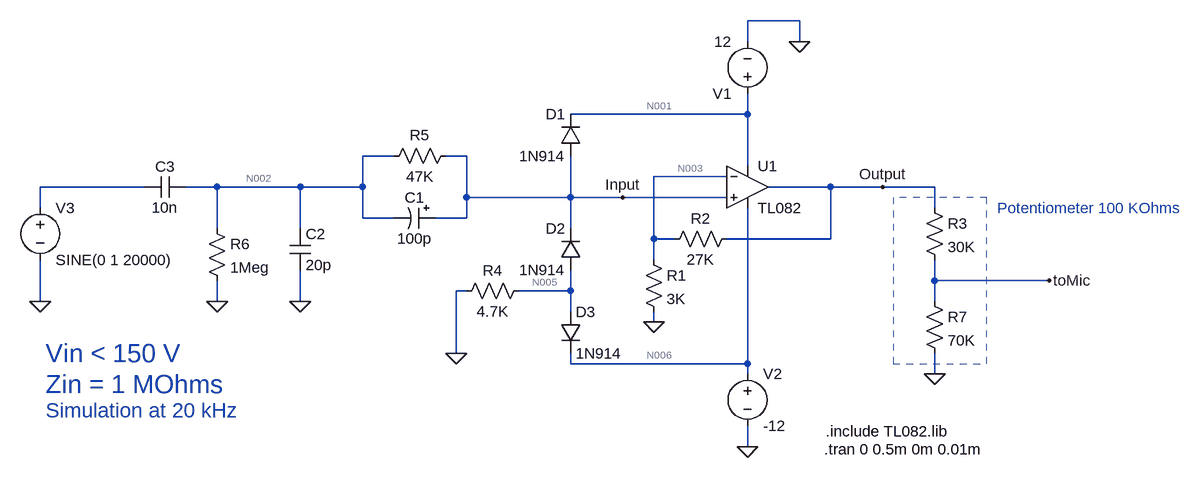
[diagram p0: schematic probes.asc]
probes.asc, the LTspice schematic file:
Version 4
SHEET 1 1404 680
WIRE 752 -240 672 -240
WIRE 672 -208 672 -240
WIRE 752 -208 752 -240
WIRE 672 -96 672 -128
WIRE 672 -96 400 -96
WIRE 128 -32 80 -32
WIRE 240 -32 208 -32
WIRE 672 -16 672 -96
WIRE 640 0 528 0
WIRE -256 16 -416 16
WIRE -144 16 -192 16
WIRE -16 16 -144 16
WIRE 80 16 80 -32
WIRE 80 16 -16 16
WIRE 800 16 704 16
WIRE 880 16 800 16
WIRE 960 16 880 16
WIRE 240 32 240 -32
WIRE 400 32 400 -32
WIRE 400 32 240 32
WIRE 480 32 400 32
WIRE 640 32 480 32
WIRE -416 48 -416 16
WIRE 960 48 960 16
WIRE 80 64 80 16
WIRE 128 64 80 64
WIRE 240 64 240 32
WIRE 240 64 192 64
WIRE -144 80 -144 16
WIRE -16 80 -16 16
WIRE 400 80 400 32
WIRE 528 96 528 0
WIRE 560 96 528 96
WIRE 800 96 800 16
WIRE 800 96 640 96
WIRE 528 128 528 96
WIRE 960 160 960 128
WIRE 1136 160 960 160
WIRE 240 176 224 176
WIRE 400 176 400 144
WIRE 400 176 320 176
WIRE -416 192 -416 128
WIRE -144 192 -144 160
WIRE -16 192 -16 144
WIRE 960 192 960 160
WIRE 400 208 400 176
WIRE 528 224 528 208
WIRE 224 272 224 176
WIRE 400 288 400 272
WIRE 672 288 672 48
WIRE 672 288 400 288
WIRE 672 304 672 288
WIRE 960 304 960 272
WIRE 672 416 672 384
FLAG 672 416 0
FLAG 752 -208 0
FLAG 224 272 0
FLAG -144 192 0
FLAG -16 192 0
FLAG -416 192 0
FLAG 960 304 0
FLAG 528 224 0
FLAG 880 16 Output
FLAG 480 32 Input
FLAG 1136 160 toMic
SYMBOL voltage 672 -112 R180
WINDOW 123 0 0 Left 2
WINDOW 39 0 0 Left 2
SYMATTR InstName V1
SYMATTR Value 12
SYMBOL voltage 672 288 R0
WINDOW 123 0 0 Left 2
WINDOW 39 0 0 Left 2
SYMATTR InstName V2
SYMATTR Value -12
SYMBOL res 512 112 R0
SYMATTR InstName R1
SYMATTR Value 3K
SYMBOL res 656 80 R90
WINDOW 0 0 56 VBottom 2
WINDOW 3 32 56 VTop 2
SYMATTR InstName R2
SYMATTR Value 27K
SYMBOL res 944 32 R0
SYMATTR InstName R3
SYMATTR Value 30K
SYMBOL diode 416 -32 R180
WINDOW 0 24 64 Left 2
WINDOW 3 24 0 Left 2
SYMATTR InstName D1
SYMATTR Value 1N914
SYMBOL diode 416 144 R180
WINDOW 0 24 64 Left 2
WINDOW 3 24 0 Left 2
SYMATTR InstName D2
SYMATTR Value 1N914
SYMBOL diode 384 208 R0
SYMATTR InstName D3
SYMATTR Value 1N914
SYMBOL res 336 160 R90
WINDOW 0 0 56 VBottom 2
WINDOW 3 32 56 VTop 2
SYMATTR InstName R4
SYMATTR Value 4.7K
SYMBOL polcap 192 48 R90
WINDOW 0 0 32 VBottom 2
WINDOW 3 32 32 VTop 2
SYMATTR InstName C1
SYMATTR Value 100p
SYMATTR Description Capacitor
SYMATTR Type cap
SYMATTR SpiceLine V=16
SYMBOL res 224 -48 R90
WINDOW 0 0 56 VBottom 2
WINDOW 3 32 56 VTop 2
SYMATTR InstName R5
SYMATTR Value 47K
SYMBOL cap -32 80 R0
SYMATTR InstName C2
SYMATTR Value 20p
SYMBOL res -160 64 R0
SYMATTR InstName R6
SYMATTR Value 1Meg
SYMATTR SpiceLine tol=1 pwr=0.1
SYMBOL cap -192 0 R90
WINDOW 0 0 32 VBottom 2
WINDOW 3 32 32 VTop 2
SYMATTR InstName C3
SYMATTR Value 10n
SYMBOL voltage -416 32 R0
WINDOW 123 0 0 Left 2
WINDOW 39 0 0 Left 2
SYMATTR InstName V3
SYMATTR Value SINE(0 1 20000)
SYMBOL res 944 176 R0
SYMATTR InstName R7
SYMATTR Value 70K
SYMBOL Opamps\\opamp2 672 -48 R0
SYMATTR InstName U1
SYMATTR Value TL082
TEXT 792 392 Left 2 !.include TL082.lib
TEXT 790 420 Left 2 !.tran 0 0.5m 0m 0.01m
TEXT 1056 48 Left 2 ;Potentiometer 100 KOhms
TEXT -408 272 Left 4 ;Vin < 150 V
TEXT -408 320 Left 4 ;Zin = 1 MOhms
TEXT -408 360 Left 3 ;Simulation at 20 kHz
LINE Normal 1040 32 896 32 2
LINE Normal 1040 288 1040 32 2
LINE Normal 896 288 1040 288 2
LINE Normal 896 32 896 288 2
LINE Normal 896 32 896 32 2
LINE Normal 896 32 896 32 2

The netlist it stands for:
* probes.asc
V1 N001 0 12
V2 N006 0 -12
R1 N003 0 3K
R2 Output N003 27K
R3 Output toMic 30K
D1 Input N001 1N914
D2 N005 Input 1N914
D3 N005 N006 1N914
R4 N005 0 4.7K
C1 Input N002 100p V=16
R5 Input N002 47K
C2 N002 0 20p
R6 N002 0 1Meg tol=1 pwr=0.1
C3 N002 N004 10n
V3 N004 0 SINE(0 1 20000)
R7 toMic 0 70K
XU1 Input N003 N001 N006 Output TL082  ; pins In+ In- V+ V- OUT
.model D D
.lib standard.dio
.include TL082.lib
.tran 0 0.5m 0m 0.01m
* Potentiometer 100 KOhms
* Vin < 150 V
* Zin = 1 MOhms
* Simulation at 20 kHz
.backanno
.end

* Results of the author's LTspice run, read from the files saved beside the schematic
* Operating Point, zero values left out:
*   V(n001) = 12 V
*   V(n006) = -12 V
*   V(n003) = -32.4 µV
*   V(output) = -322.9 µV
*   V(tomic) = -226 µV
*   V(input) = -43.37 µV
*   V(n005) = -11.37 V
*   V(n002) = -41.43 µV
*   I(D3) = 2.42 mA
*   I(D2) = -2.531 nA
*   I(D1) = -2.532 nA
*   I(R7) = -3.229 nA
*   I(R6) = -41.43 pA
*   I(R5) = -41.43 pA
*   I(R4) = -2.42 mA
*   I(R3) = -3.229 nA
*   I(R2) = -10.76 nA
*   I(R1) = -10.8 nA
*   I(V2) = 13.81 mA
*   I(V1) = -11.39 mA
*   Ix(u1:1) = 42.05 pA
*   Ix(u1:2) = 42.05 pA
*   Ix(u1:3) = 11.39 mA
*   Ix(u1:4) = -11.39 mA
*   Ix(u1:5) = 13.99 nA
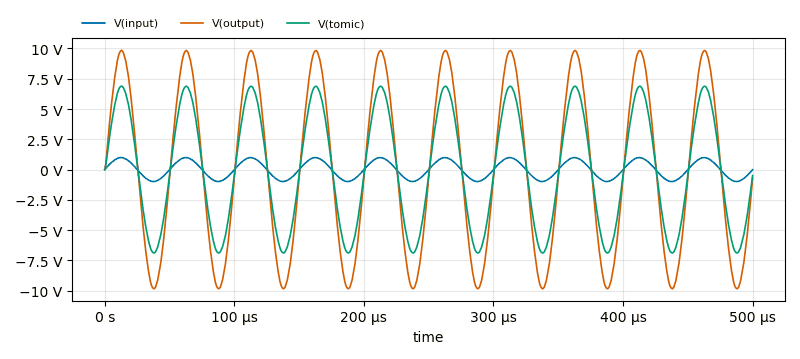
[diagram p1: Transient Analysis of probes.asc, plotted from the saved traces]
* Transient Analysis, 1 run:
*   V(input): min -984.7 mV, max 986.4 mV, average -608.3 µV, rms 693.5 mV, last -12.52 mV
*   V(output): min -9.848 V, max 9.845 V, average -5.139 mV, rms 6.923 V, last -702.5 mV
*   V(tomic): min -6.893 V, max 6.891 V, average -3.597 mV, rms 4.846 V, last -491.7 mV